# EasyEDA schematic 1-Schematic_SAO HACKGDL 2025.json
TITLE: SAO Femec HackGDL 2025; REV: 1.0; Date: 2024-11-25; Sheet: 1/1; Drawn By: femec.oficial; Company: FEMEC
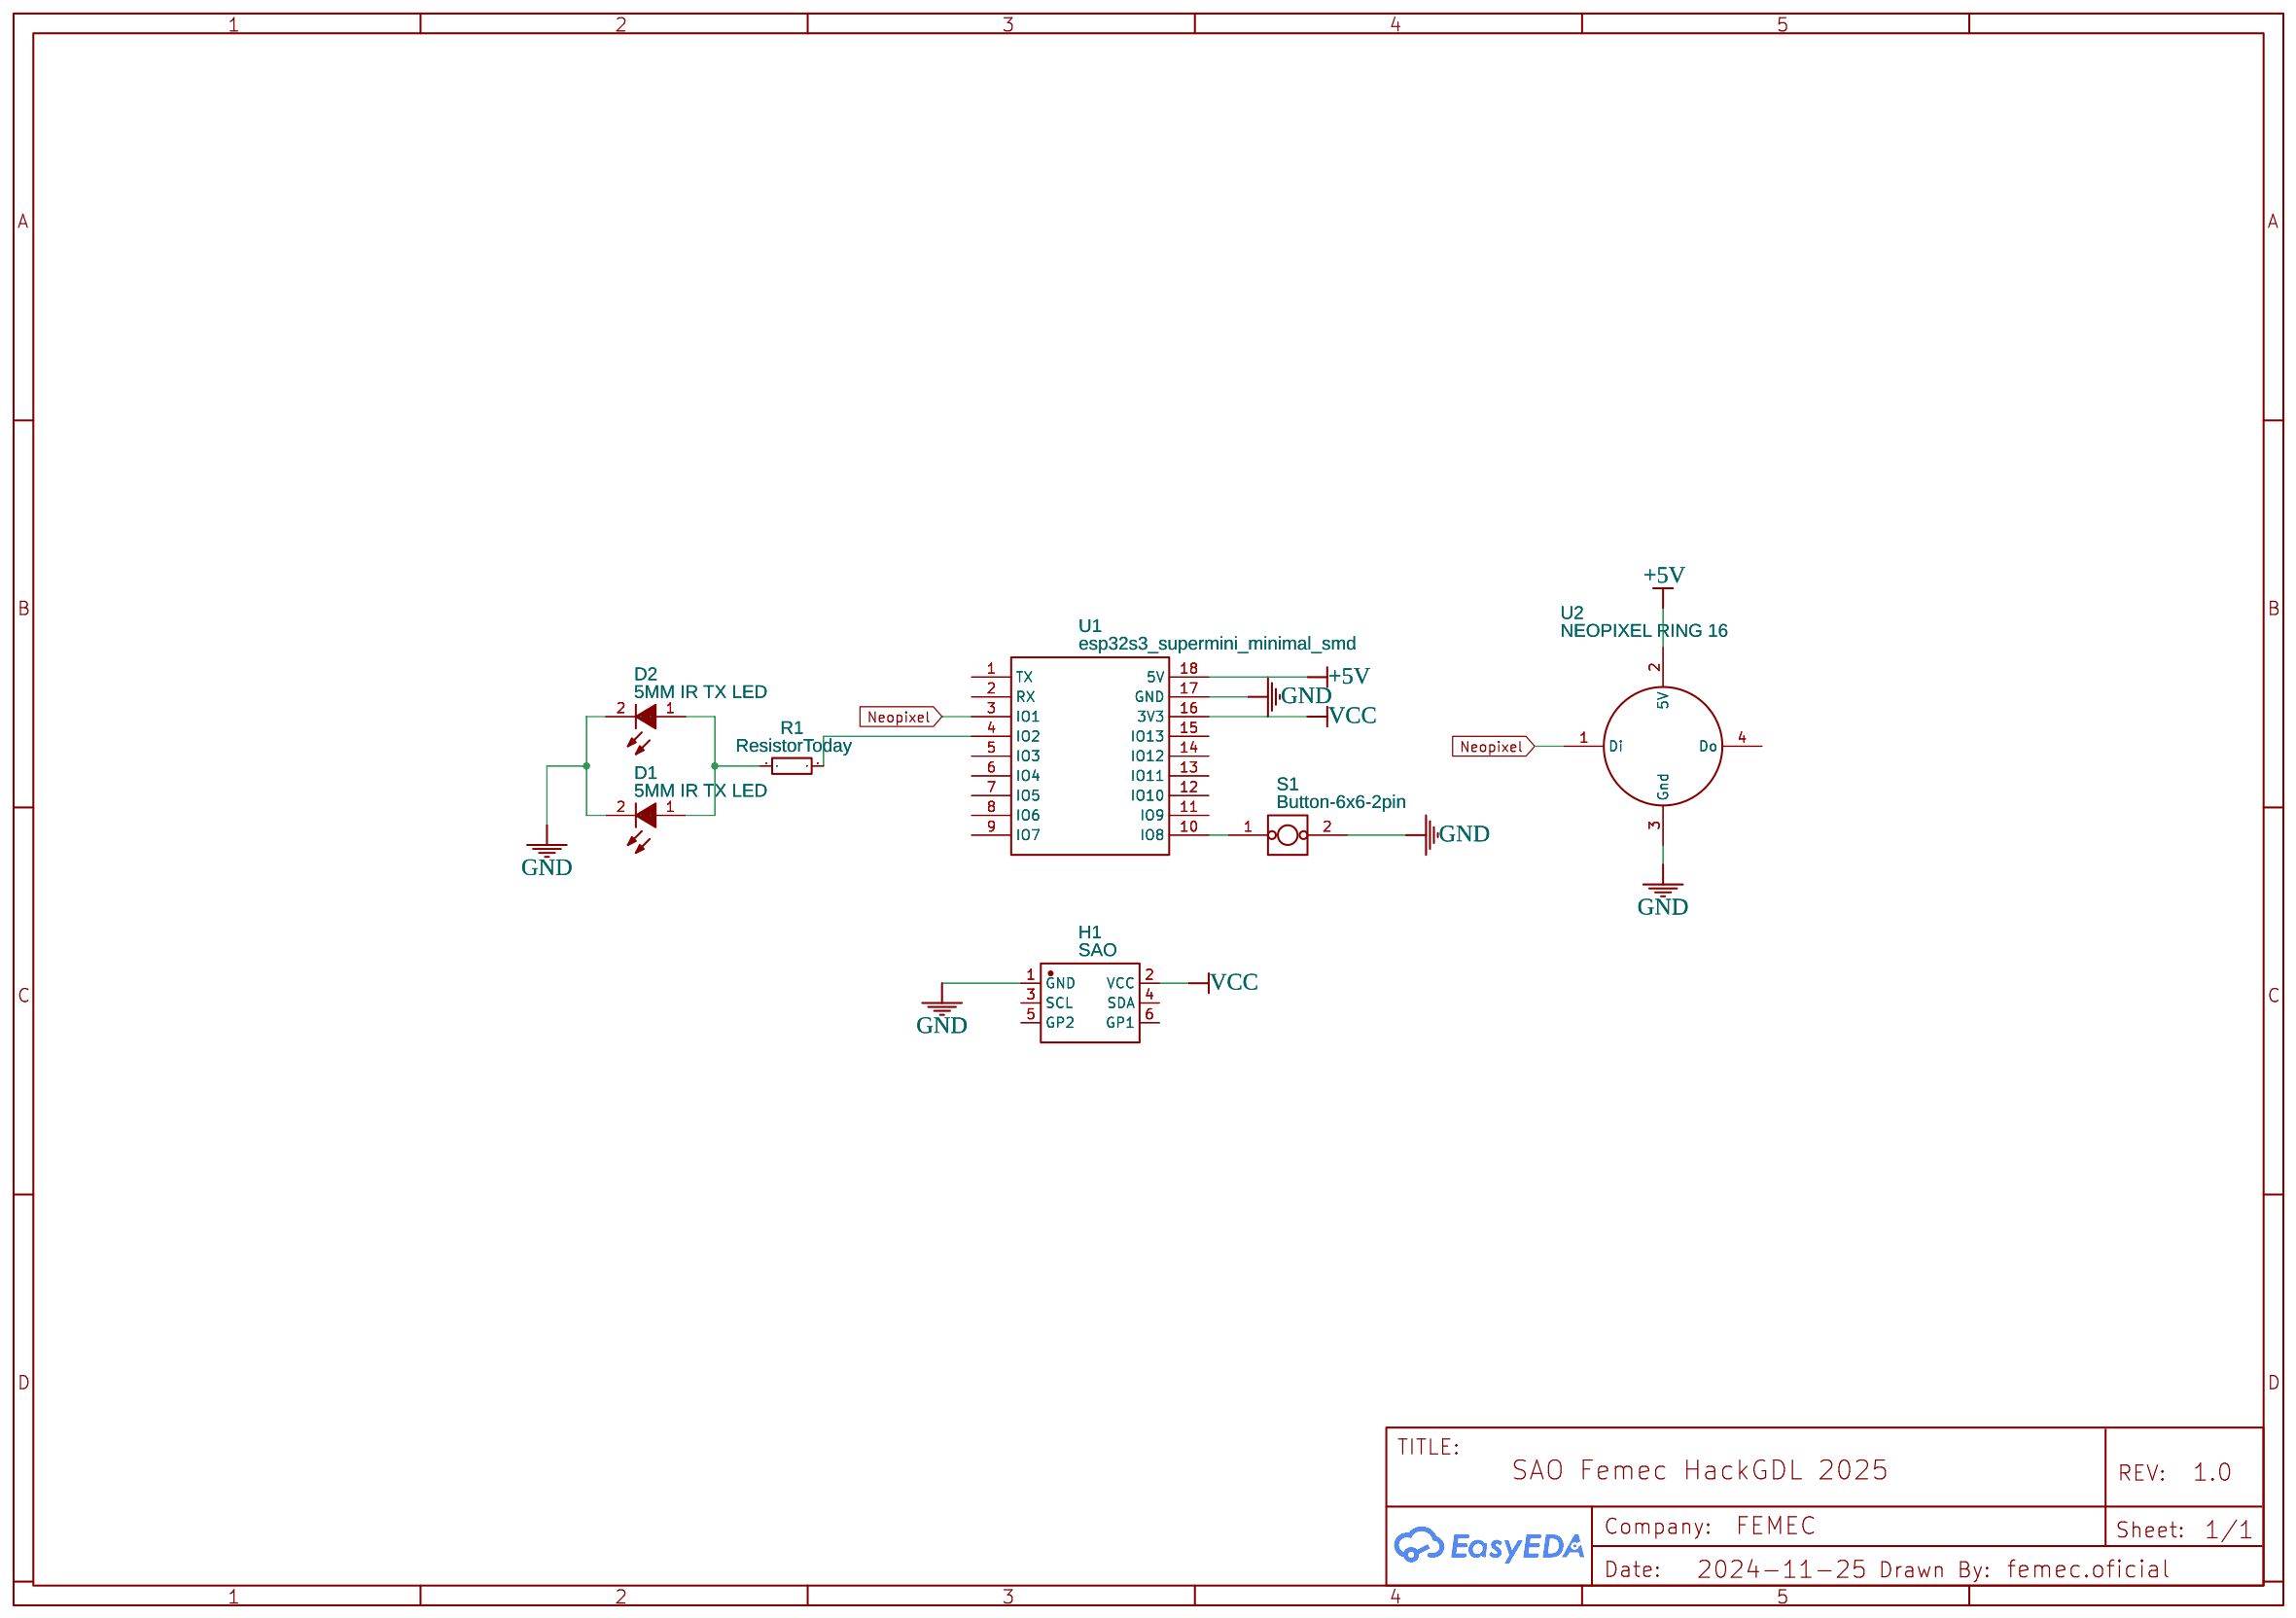
[diagram p0: schematic sheet]

## Parts
D1  5MM IR TX LED  [LED-TH_LED-DP2-2LED]
D2  5MM IR TX LED  [LED-TH_LED-DP2-2LED]
H1  SAO  [SAO-BADGE]
R1  ResistorToday  [FIXED RESISTOR]
S1  Button-6x6-2pin  [BUTTON-6X6-2PIN]
U1  esp32s3_supermini_minimal_smd  [ESP32_S3_SUPERMINI_MINIMAL_SMD]
U2  NEOPIXEL RING 16  [NEOPIXEL RING 16]

## Library data of the parts
D1 D2 = 3mm Green TH LED 5600: Supplier: Digi-Key; Manufacturer: VccLite; Manufacturer Part: 5600; Supplier Part: L20325-ND; link: https://vcclite.com/product/5602f5-5v/; Contributor: nguynltt
H1 = SAO: Contributor: 5volts
R1 = RESISTOR NORMAL: Supplier: LCSC; Supplier Part: X16151710; Manufacturer Part: EWWR0001J20R0T9; Contributor: MehmetCan94
S1 = Button-6x6-2pin: sourceId: K60iAuM3l; Contributor: epicfaillppro
U1 = esp32s3_supermini_minimal_smd: Contributor: Joe Ostrander
U2 = NEOPIXEL RING 16: Contributor: Jeremy78

## Nets
+5V: U1.18(5V) U2.2(5V)
GND: D1.2(K) D2.2(K) H1.1(GND) S1.2 U1.17(GND) U2.3(Gnd)
VCC: H1.2(VCC) U1.16(3V3)
Neopixel: U1.3(IO1) U2.1(Di)
Net-(D1-1): D1.1(A) D2.1(A) R1.1
Net-(R1-2): R1.2 U1.4(IO2)
Net-(S1-1): S1.1 U1.10(IO8)

Not connected (* = marked no-connect by the designer): H1 3(SCL) 4(SDA) 5(GP2) 6(GP1); U1 1(TX) 2(RX) 5(IO3) 6(IO4) 7(IO5) 8(IO6) 9(IO7) 11(IO9) 12(IO10) 13(IO11) 14(IO12) 15(IO13); U2 4(Do)
